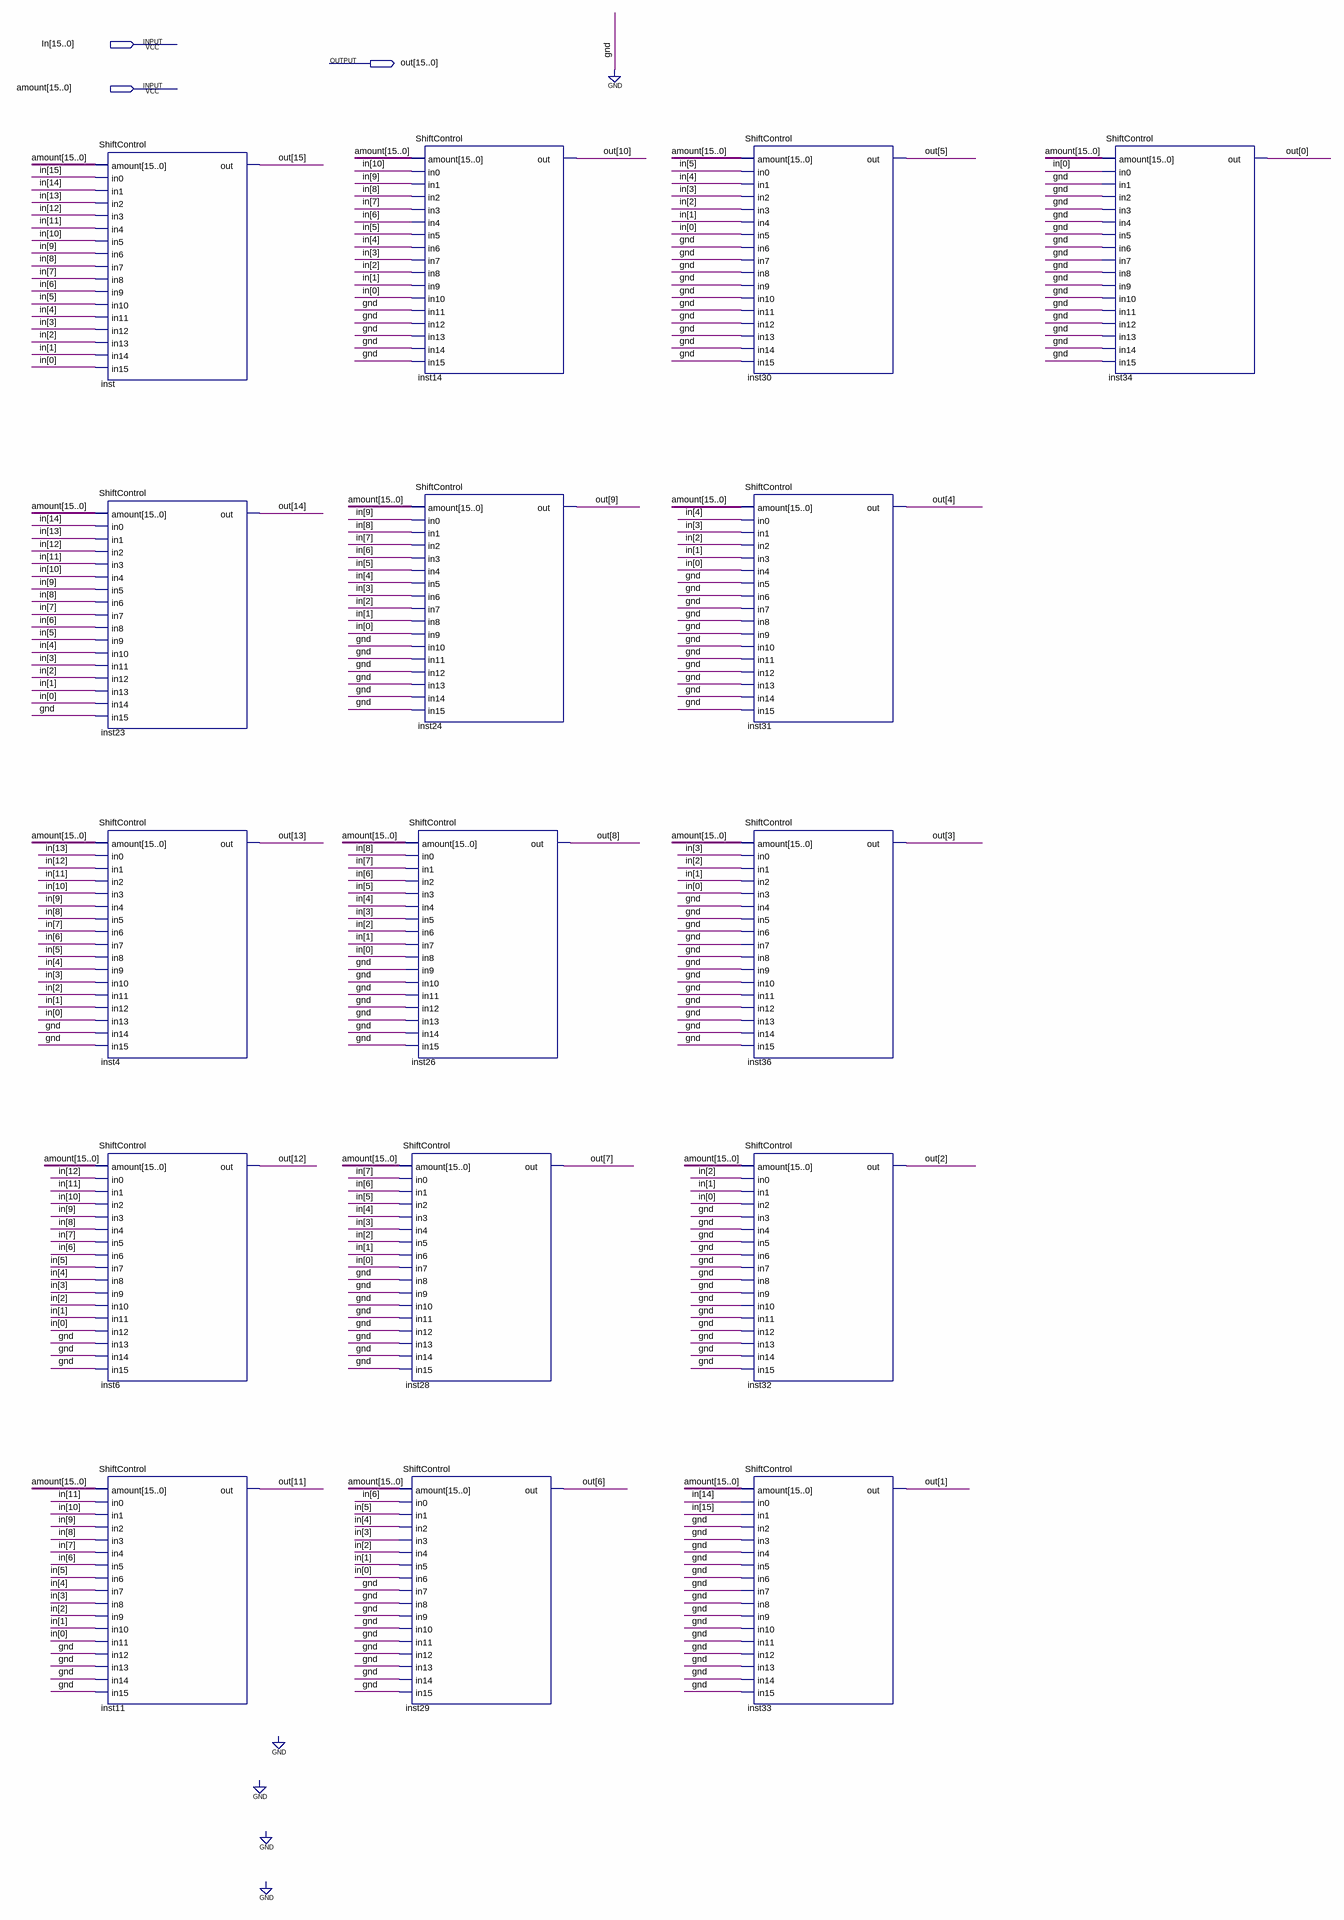
[diagram p0: schematic sheet]
// Quartus schematic ShiftLeft16.bdf as structural Verilog: 16 symbols, 3 pins
module ShiftLeft16 (
  input  [15:0] In,
  input  [15:0] amount,
  output [15:0] out
);

  ShiftControl inst (
    .amount(amount), .in0(In[15]), .in1(In[14]), .in2(In[13]), .in3(In[12]), .in4(In[11]), .in5(In[10]),
    .in6(In[9]), .in7(In[8]), .in8(In[7]), .in9(In[6]), .in10(In[5]), .in11(In[4]), .in12(In[3]),
    .in13(In[2]), .in14(In[1]), .in15(In[0]), .out(out[15]));
  ShiftControl inst23 (
    .amount(amount), .in0(In[14]), .in1(In[13]), .in2(In[12]), .in3(In[11]), .in4(In[10]), .in5(In[9]),
    .in6(In[8]), .in7(In[7]), .in8(In[6]), .in9(In[5]), .in10(In[4]), .in11(In[3]), .in12(In[2]),
    .in13(In[1]), .in14(In[0]), .in15(1'b0), .out(out[14]));
  ShiftControl inst4 (
    .amount(amount), .in0(In[13]), .in1(In[12]), .in2(In[11]), .in3(In[10]), .in4(In[9]), .in5(In[8]),
    .in6(In[7]), .in7(In[6]), .in8(In[5]), .in9(In[4]), .in10(In[3]), .in11(In[2]), .in12(In[1]),
    .in13(In[0]), .in14(1'b0), .in15(1'b0), .out(out[13]));
  ShiftControl inst6 (
    .amount(amount), .in0(In[12]), .in1(In[11]), .in2(In[10]), .in3(In[9]), .in4(In[8]), .in5(In[7]),
    .in6(In[6]), .in7(In[5]), .in8(In[4]), .in9(In[3]), .in10(In[2]), .in11(In[1]), .in12(In[0]),
    .in13(1'b0), .in14(1'b0), .in15(1'b0), .out(out[12]));
  ShiftControl inst11 (
    .amount(amount), .in0(In[11]), .in1(In[10]), .in2(In[9]), .in3(In[8]), .in4(In[7]), .in5(In[6]),
    .in6(In[5]), .in7(In[4]), .in8(In[3]), .in9(In[2]), .in10(In[1]), .in11(In[0]), .in12(1'b0), .in13(1'b0),
    .in14(1'b0), .in15(1'b0), .out(out[11]));
  ShiftControl inst26 (
    .amount(amount), .in0(In[8]), .in1(In[7]), .in2(In[6]), .in3(In[5]), .in4(In[4]), .in5(In[3]),
    .in6(In[2]), .in7(In[1]), .in8(In[0]), .in9(1'b0), .in10(1'b0), .in11(1'b0), .in12(1'b0), .in13(1'b0),
    .in14(1'b0), .in15(1'b0), .out(out[8]));
  ShiftControl inst28 (
    .amount(amount), .in0(In[7]), .in1(In[6]), .in2(In[5]), .in3(In[4]), .in4(In[3]), .in5(In[2]),
    .in6(In[1]), .in7(In[0]), .in8(1'b0), .in9(1'b0), .in10(1'b0), .in11(1'b0), .in12(1'b0), .in13(1'b0),
    .in14(1'b0), .in15(1'b0), .out(out[7]));
  ShiftControl inst29 (
    .amount(amount), .in0(In[6]), .in1(In[5]), .in2(In[4]), .in3(In[3]), .in4(In[2]), .in5(In[1]),
    .in6(In[0]), .in7(1'b0), .in8(1'b0), .in9(1'b0), .in10(1'b0), .in11(1'b0), .in12(1'b0), .in13(1'b0),
    .in14(1'b0), .in15(1'b0), .out(out[6]));
  ShiftControl inst14 (
    .amount(amount), .in0(In[10]), .in1(In[9]), .in2(In[8]), .in3(In[7]), .in4(In[6]), .in5(In[5]),
    .in6(In[4]), .in7(In[3]), .in8(In[2]), .in9(In[1]), .in10(In[0]), .in11(1'b0), .in12(1'b0), .in13(1'b0),
    .in14(1'b0), .in15(1'b0), .out(out[10]));
  ShiftControl inst24 (
    .amount(amount), .in0(In[9]), .in1(In[8]), .in2(In[7]), .in3(In[6]), .in4(In[5]), .in5(In[4]),
    .in6(In[3]), .in7(In[2]), .in8(In[1]), .in9(In[0]), .in10(1'b0), .in11(1'b0), .in12(1'b0), .in13(1'b0),
    .in14(1'b0), .in15(1'b0), .out(out[9]));
  ShiftControl inst30 (
    .amount(amount), .in0(In[5]), .in1(In[4]), .in2(In[3]), .in3(In[2]), .in4(In[1]), .in5(In[0]),
    .in6(1'b0), .in7(1'b0), .in8(1'b0), .in9(1'b0), .in10(1'b0), .in11(1'b0), .in12(1'b0), .in13(1'b0),
    .in14(1'b0), .in15(1'b0), .out(out[5]));
  ShiftControl inst31 (
    .amount(amount), .in0(In[4]), .in1(In[3]), .in2(In[2]), .in3(In[1]), .in4(In[0]), .in5(1'b0), .in6(1'b0),
    .in7(1'b0), .in8(1'b0), .in9(1'b0), .in10(1'b0), .in11(1'b0), .in12(1'b0), .in13(1'b0), .in14(1'b0),
    .in15(1'b0), .out(out[4]));
  ShiftControl inst36 (
    .amount(amount), .in0(In[3]), .in1(In[2]), .in2(In[1]), .in3(In[0]), .in4(1'b0), .in5(1'b0), .in6(1'b0),
    .in7(1'b0), .in8(1'b0), .in9(1'b0), .in10(1'b0), .in11(1'b0), .in12(1'b0), .in13(1'b0), .in14(1'b0),
    .in15(1'b0), .out(out[3]));
  ShiftControl inst32 (
    .amount(amount), .in0(In[2]), .in1(In[1]), .in2(In[0]), .in3(1'b0), .in4(1'b0), .in5(1'b0), .in6(1'b0),
    .in7(1'b0), .in8(1'b0), .in9(1'b0), .in10(1'b0), .in11(1'b0), .in12(1'b0), .in13(1'b0), .in14(1'b0),
    .in15(1'b0), .out(out[2]));
  ShiftControl inst33 (
    .amount(amount), .in0(In[14]), .in1(In[15]), .in2(1'b0), .in3(1'b0), .in4(1'b0), .in5(1'b0), .in6(1'b0),
    .in7(1'b0), .in8(1'b0), .in9(1'b0), .in10(1'b0), .in11(1'b0), .in12(1'b0), .in13(1'b0), .in14(1'b0),
    .in15(1'b0), .out(out[1]));
  ShiftControl inst34 (
    .amount(amount), .in0(In[0]), .in1(1'b0), .in2(1'b0), .in3(1'b0), .in4(1'b0), .in5(1'b0), .in6(1'b0),
    .in7(1'b0), .in8(1'b0), .in9(1'b0), .in10(1'b0), .in11(1'b0), .in12(1'b0), .in13(1'b0), .in14(1'b0),
    .in15(1'b0), .out(out[0]));
endmodule
